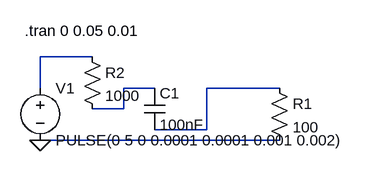
[diagram p0: schematic Draft8.asc]
Draft8.asc, the LTspice schematic file:
Version 4
SHEET 1 880 680
WIRE 368 176 288 176
WIRE 288 224 288 176
WIRE 464 224 416 224
WIRE 656 224 544 224
WIRE 416 256 416 224
WIRE 416 256 368 256
WIRE 544 288 544 224
WIRE 544 288 464 288
WIRE 656 304 288 304
FLAG 288 304 0
SYMBOL voltage 288 208 R0
SYMATTR InstName V1
SYMATTR Value PULSE(0 5 0 0.0001 0.0001 0.001 0.002)
SYMBOL res 640 208 R0
SYMATTR InstName R1
SYMATTR Value 100
SYMBOL cap 448 224 R0
SYMATTR InstName C1
SYMATTR Value 100nF
SYMBOL res 352 160 R0
SYMATTR InstName R2
SYMATTR Value 1000
TEXT 264 136 Left 2 !.tran 0 0.05 0.01

The netlist it stands for:
* Draft8.asc
V1 N001 0 PULSE(0 5 0 0.0001 0.0001 0.001 0.002)
R1 N003 0 100
C1 N002 N003 100nF
R2 N001 N002 1000
.tran 0 0.05 0.01
.backanno
.end